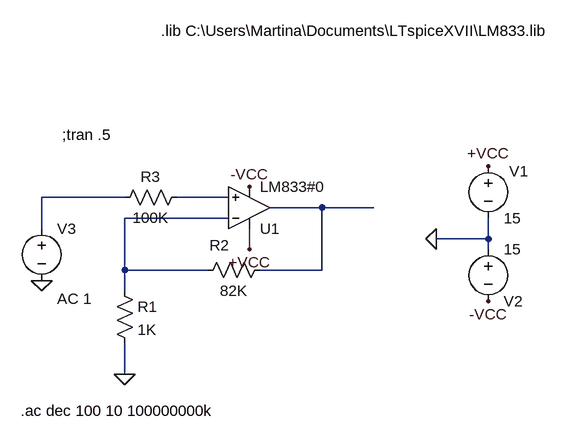
[diagram p0: schematic Draft1.asc]
Draft1.asc, the LTspice schematic file:
Version 4
SHEET 1 880 680
WIRE -16 176 -144 176
WIRE 144 176 64 176
WIRE 288 192 208 192
WIRE 368 192 288 192
WIRE 144 208 -16 208
WIRE -144 224 -144 176
WIRE 544 240 544 208
WIRE 544 240 464 240
WIRE 176 256 176 224
WIRE 544 256 544 240
WIRE -16 288 -16 208
WIRE 112 288 -16 288
WIRE 288 288 288 192
WIRE 288 288 192 288
WIRE -16 320 -16 288
WIRE -16 448 -16 400
FLAG -16 448 0
FLAG 464 240 0
FLAG -144 304 0
FLAG 176 256 +VCC
FLAG 176 160 -VCC
FLAG 544 128 +VCC
FLAG 544 336 -VCC
SYMBOL res -32 304 R0
SYMATTR InstName R1
SYMATTR Value 1K
SYMBOL res 208 272 R90
WINDOW 0 -7 78 VBottom 2
WINDOW 3 32 56 VTop 2
SYMATTR InstName R2
SYMATTR Value 82K
SYMBOL res 80 160 R90
WINDOW 0 0 56 VBottom 2
WINDOW 3 32 56 VTop 2
SYMATTR InstName R3
SYMATTR Value 100K
SYMBOL voltage 544 112 R0
WINDOW 123 0 0 Left 2
WINDOW 39 0 0 Left 2
WINDOW 0 32 24 Left 2
SYMATTR InstName V1
SYMATTR Value 15
SYMBOL voltage 544 240 R0
WINDOW 0 24 96 Left 2
WINDOW 3 24 16 Left 2
WINDOW 123 0 0 Left 2
WINDOW 39 0 0 Left 2
SYMATTR InstName V2
SYMATTR Value 15
SYMBOL voltage -144 208 R0
WINDOW 123 24 124 Left 2
WINDOW 39 0 0 Left 2
WINDOW 3 24 44 Left 2
SYMATTR Value2 AC 1
SYMATTR Value ""
SYMATTR InstName V3
SYMBOL Opamps\\opamp2 176 256 M180
SYMATTR InstName U1
SYMATTR Value LM833#0
TEXT -176 504 Left 2 !.ac dec 100 10 100000000k
TEXT -112 80 Left 2 !;tran .5
TEXT 40 -80 Left 2 !.lib C:\\Users\\Martina\\Documents\\LTspiceXVII\\LM833.lib

The netlist it stands for:
* Draft1.asc
R1 N004 0 1K
R2 N003 N004 82K
R3 N002 N001 100K
V1 +VCC 0 15
V2 0 -VCC 15
V3 N001 0 AC 1
XU1 N002 N004 +VCC -VCC N003 LM833#0  ; pins In+ In- V+ V- OUT
.ac dec 100 10 100000000k
;tran .5
.lib C:\Users\Martina\Documents\LTspiceXVII\LM833.lib
.backanno
.end